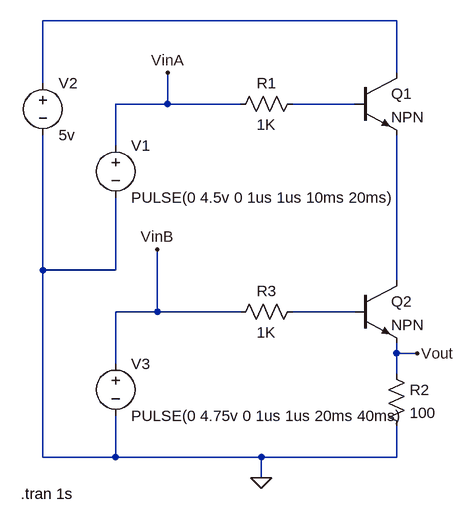
[diagram p0: schematic NAND.asc]
NAND.asc, the LTspice schematic file:
Version 4
SHEET 1 880 680
WIRE 464 -80 -80 -80
WIRE 464 0 464 -80
WIRE -80 16 -80 -80
WIRE 112 48 112 0
WIRE 112 48 32 48
WIRE 224 48 112 48
WIRE 400 48 304 48
WIRE 32 112 32 48
WIRE -80 304 -80 96
WIRE 32 304 32 192
WIRE 32 304 -80 304
WIRE 464 320 464 96
WIRE 96 368 96 272
WIRE 96 368 32 368
WIRE 224 368 96 368
WIRE 400 368 304 368
WIRE 464 432 464 416
WIRE 496 432 464 432
WIRE 32 448 32 368
WIRE 464 464 464 432
WIRE -80 592 -80 304
WIRE 32 592 32 528
WIRE 32 592 -80 592
WIRE 256 592 32 592
WIRE 464 592 464 544
WIRE 464 592 256 592
WIRE 256 624 256 592
FLAG 112 0 VinA
FLAG 496 432 Vout
FLAG 96 272 VinB
FLAG 256 624 0
SYMBOL voltage 32 96 R0
WINDOW 123 0 0 Left 0
WINDOW 39 0 0 Left 0
SYMATTR InstName V1
SYMATTR Value PULSE(0 4.5v 0 1us 1us 10ms 20ms)
SYMBOL res 320 32 R90
WINDOW 0 0 56 VBottom 2
WINDOW 3 32 56 VTop 2
SYMATTR InstName R1
SYMATTR Value 1K
SYMBOL npn 400 0 R0
SYMATTR InstName Q1
SYMBOL voltage -80 0 R0
SYMATTR InstName V2
SYMATTR Value 5v
SYMBOL npn 400 320 R0
SYMATTR InstName Q2
SYMBOL res 448 448 R0
SYMATTR InstName R2
SYMATTR Value 100
SYMBOL voltage 32 432 R0
WINDOW 123 0 0 Left 0
WINDOW 39 0 0 Left 0
SYMATTR InstName V3
SYMATTR Value PULSE(0 4.75v 0 1us 1us 20ms 40ms)
SYMBOL res 320 352 R90
WINDOW 0 0 56 VBottom 2
WINDOW 3 32 56 VTop 2
SYMATTR InstName R3
SYMATTR Value 1K
TEXT -114 648 Left 2 !.tran 1s

The netlist it stands for:
* NAND.asc
V1 VinA 0 PULSE(0 4.5v 0 1us 1us 10ms 20ms)
R1 N002 VinA 1K
Q1 N001 N002 N003 0 NPN
V2 N001 0 5v
Q2 N003 N004 Vout 0 NPN
R2 Vout 0 100
V3 VinB 0 PULSE(0 4.75v 0 1us 1us 20ms 40ms)
R3 N004 VinB 1K
.model NPN NPN
.model PNP PNP
.lib standard.bjt
.tran 1s
.backanno
.end